# EasyEDA Pro project ProPrj_AIHi_2025-07-12.epro

# Schematic Schematic1

## Sheets
1 P1: Board Name: Board1; Create Date: 2025-07-11; Page Name: P1; Project Name: AIHi; Schematic Name: Schematic1; Update Date: 2025-07-11; Company: 嘉立创EDA; Drawed: hric; Page Size: A4; Version: V1.0
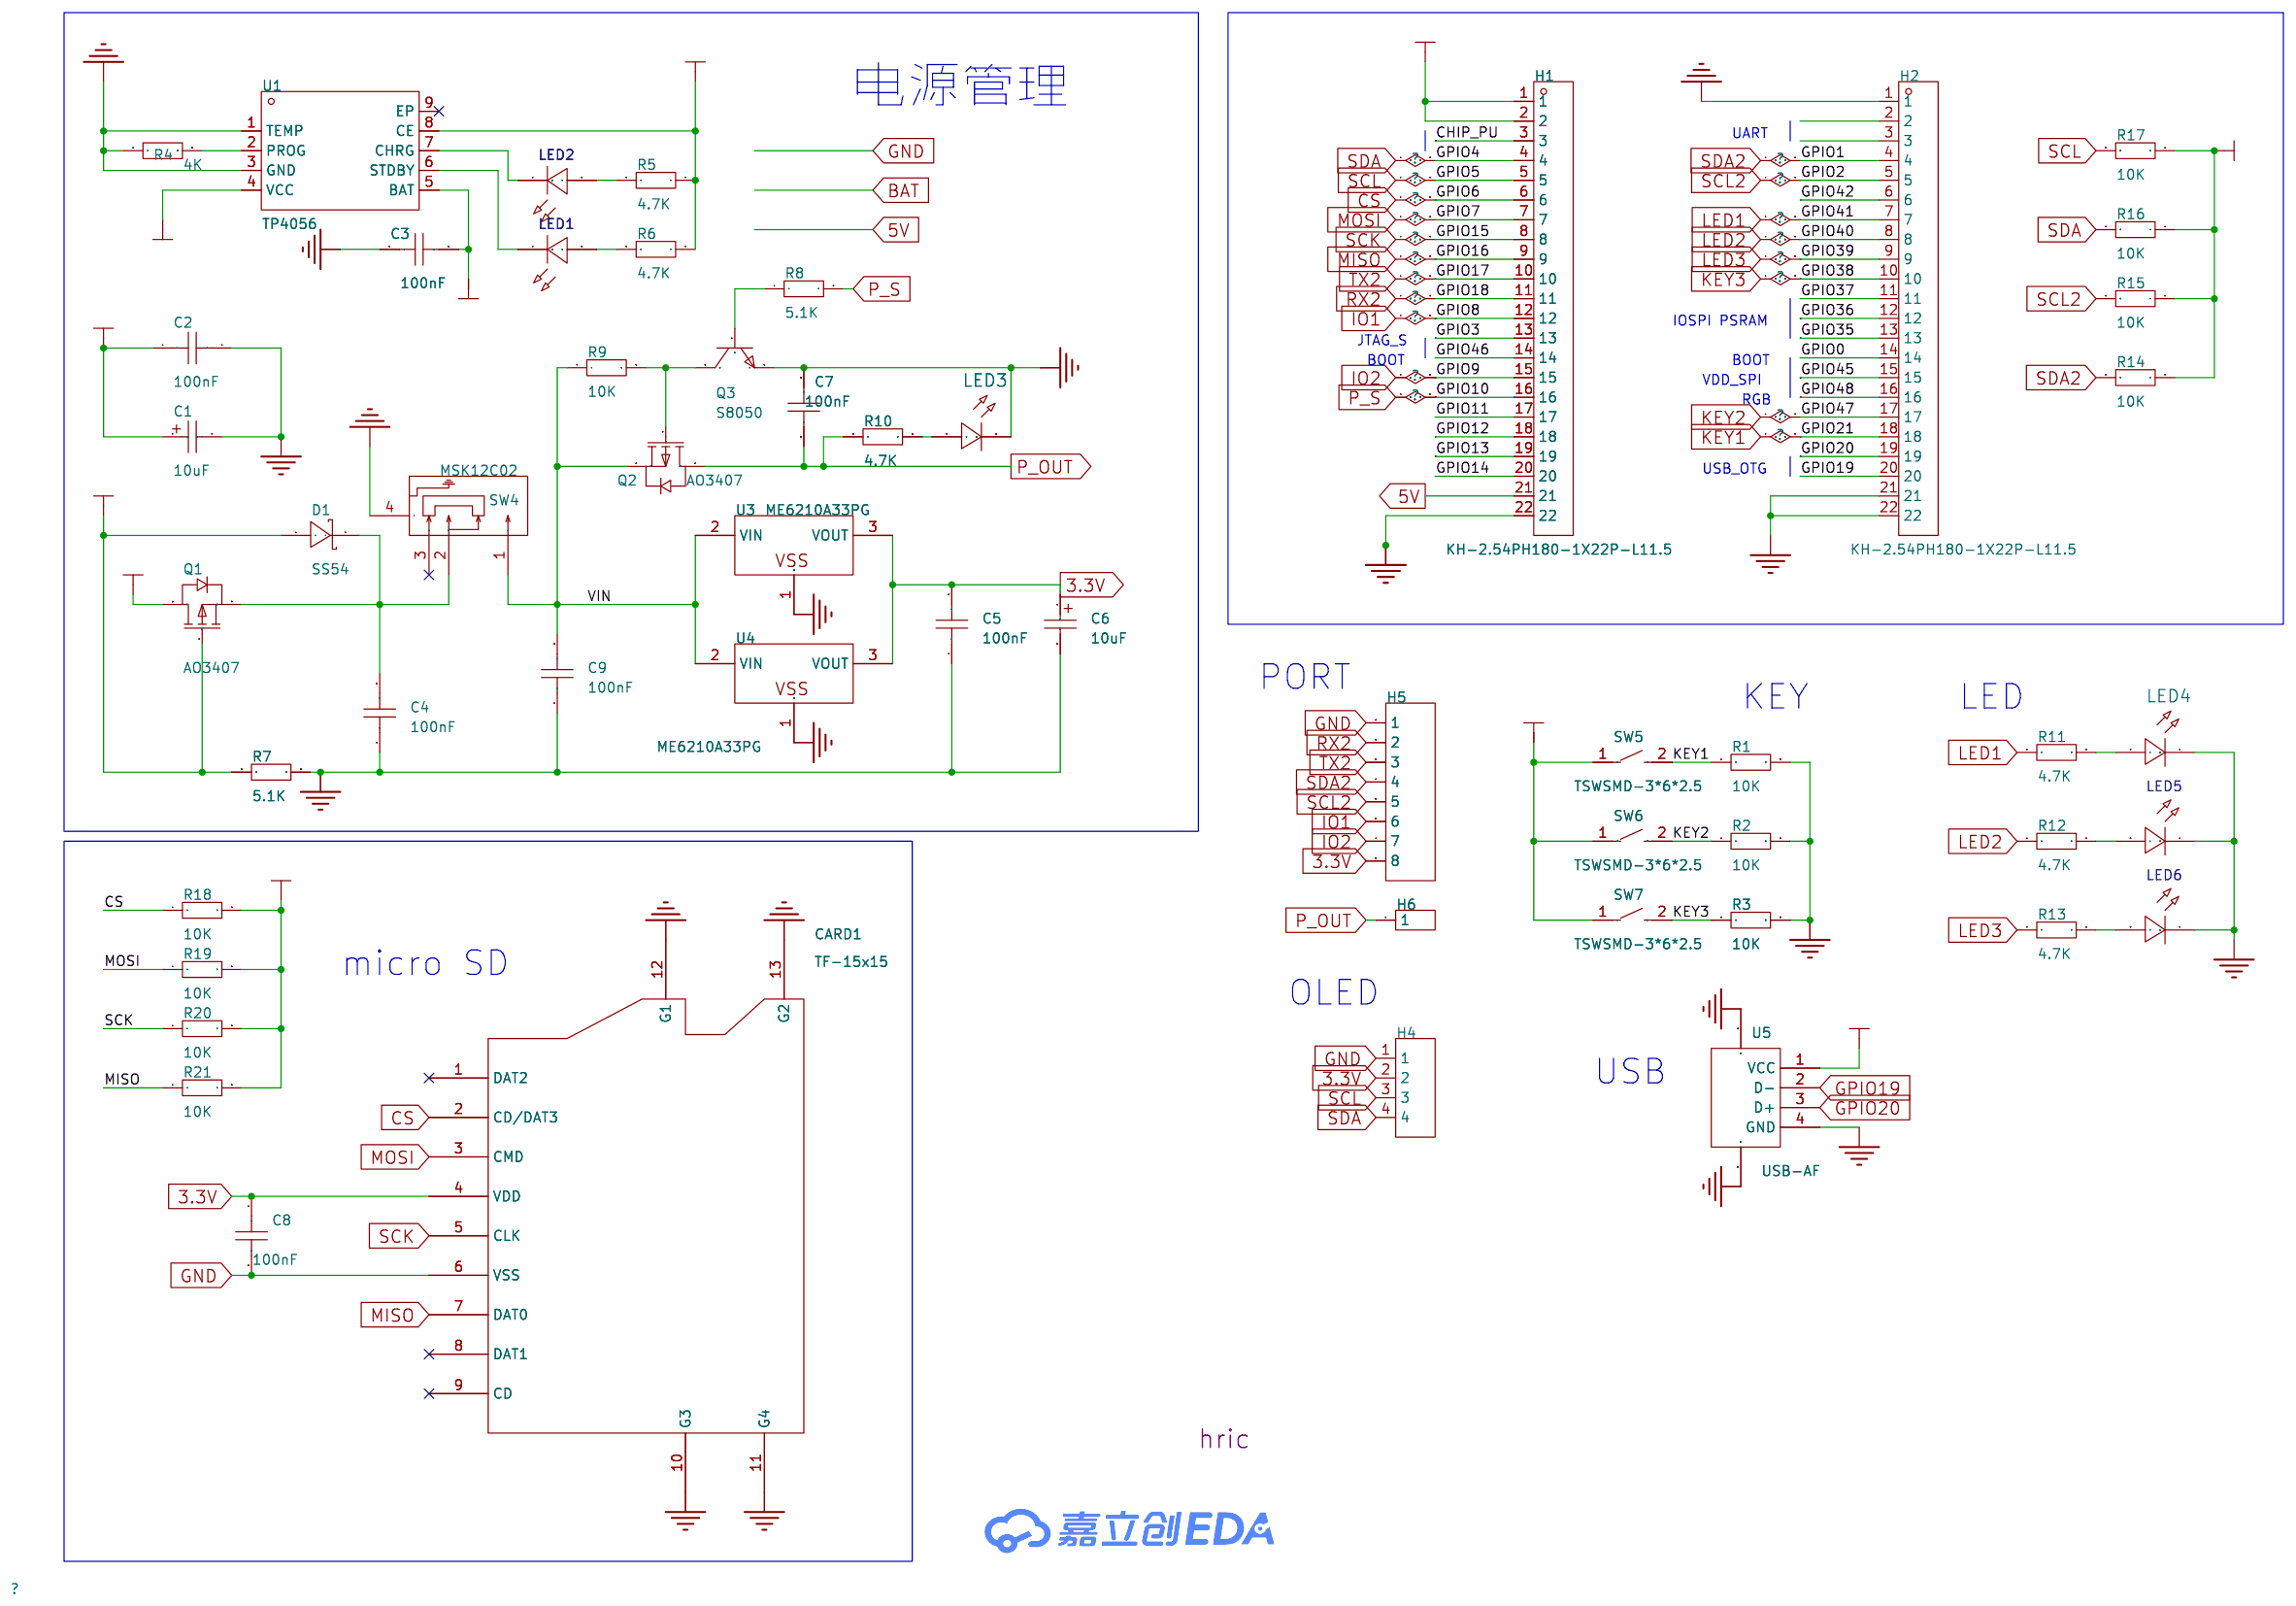
[diagram p0: P1]
2 P2
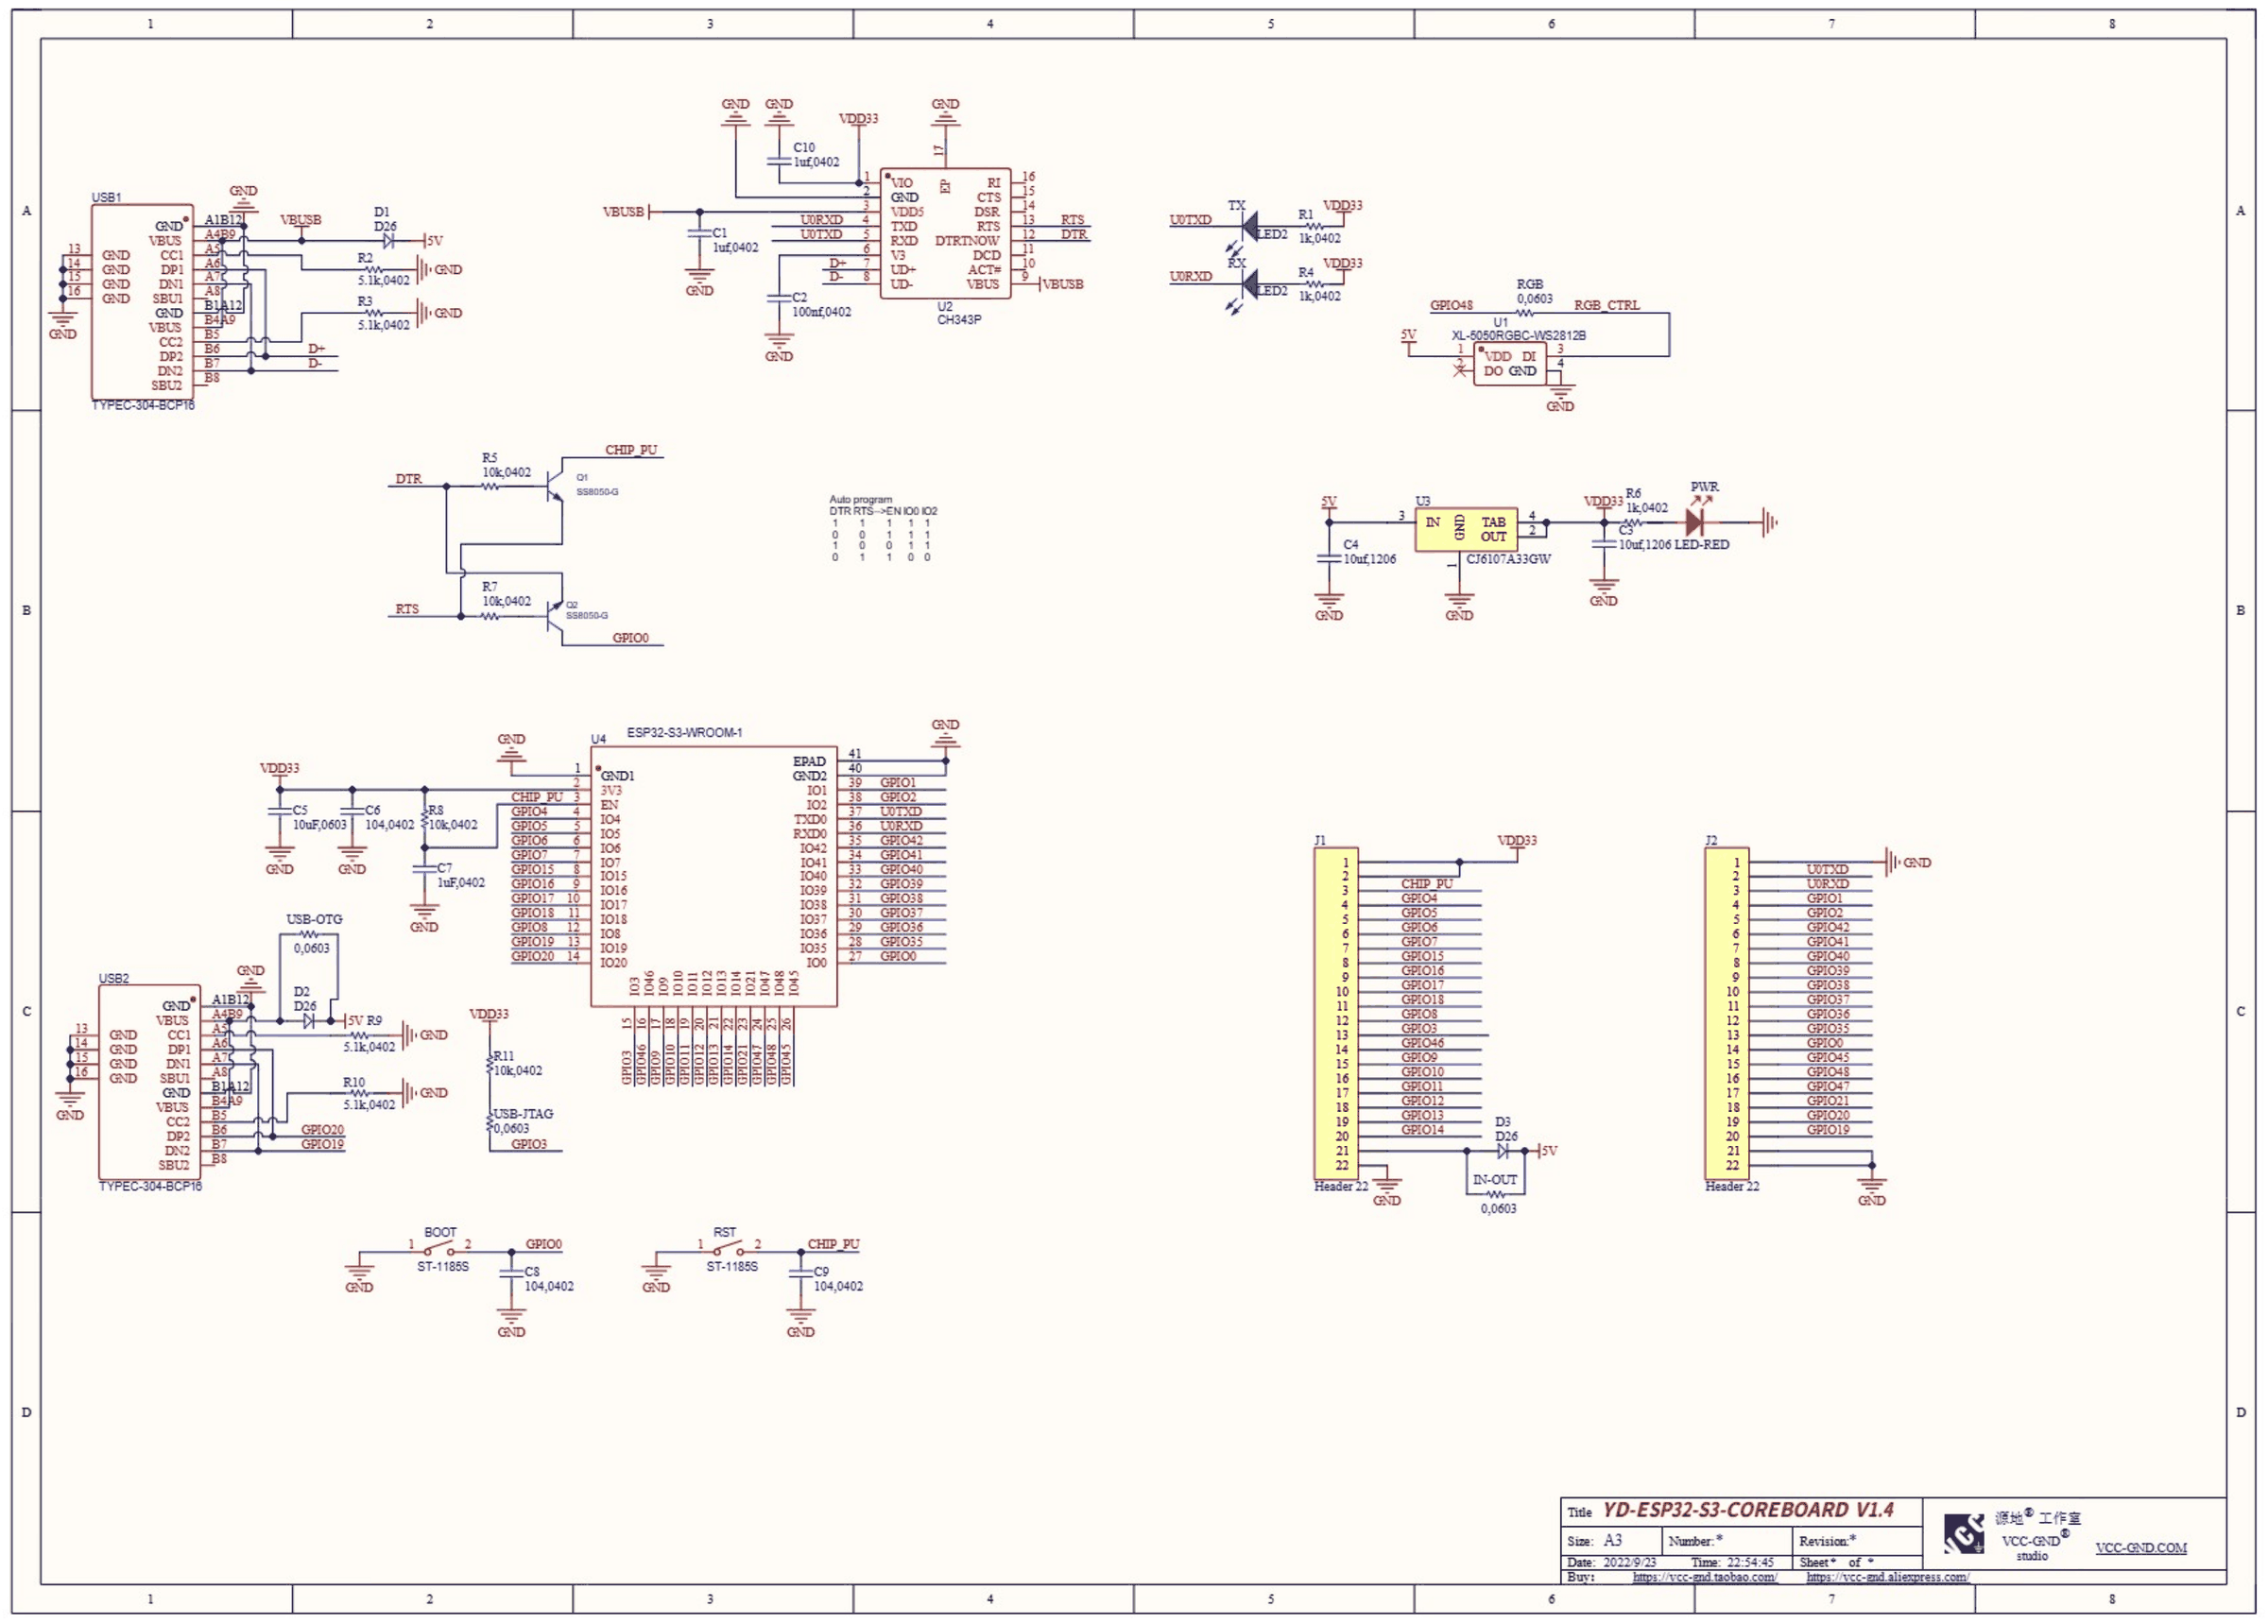
[diagram p1: P2]

## Parts
C1  10uF  [C_Ele_SMD_4x5.5mm]
C2  100nF  [C0805]
C3  100nF  [C0805]
C4  100nF  [C0805]
C5  100nF  [C0805]
C6  10uF  [C_Ele_SMD_4x5.5mm]
C7  100nF  [C0805]
C8  100nF  [C0805]
C9  100nF  [C0805]
CARD1  TF-15x15  [TF-SMD_TF-15-15]
D1  SS54  [SMA_L4.4-W2.8-LS5.4-R-RD]
H1  KH-2.54PH180-1X22P-L11.5  [HDR-TH_22P-P2.54-V-M]
H2  KH-2.54PH180-1X22P-L11.5  [HDR-TH_22P-P2.54-V-M]
H4  -  [HDR-TH_4P-P2.54-V-M]
H5  -  [HDR-TH_8P-P2.54-V-M]
H6  -  [HDR-TH_1P-V-M_XKB_X4611WV-01I-C28D40]
LED1  -  [LED_0805]
LED2  -  [LED_0805]
LED3  -  [LED_0805]
LED4  -  [LED_0805]
LED5  -  [LED_0805]
LED6  -  [LED_0805]
Q1  AO3407  [SOT-23-3_L2.9-W1.6-P1.90-LS2.8-BR]
Q2  AO3407  [SOT-23-3_L2.9-W1.6-P1.90-LS2.8-BR]
Q3  S8050  [SOT-23-3_L2.9-W1.3-P1.90-LS2.4-BR]
R1  10K  [R0805]
R2  10K  [R0805]
R3  10K  [R0805]
R4  4K  [R0805]
R5  4.7K  [R0805]
R6  4.7K  [R0805]
R7  5.1K  [R0805]
R8  5.1K  [R0805]
R9  10K  [R0805]
R10  4.7K  [R0805]
R11  4.7K  [R0805]
R12  4.7K  [R0805]
R13  4.7K  [R0805]
R14  10K  [R0805]
R15  10K  [R0805]
R16  10K  [R0805]
R17  10K  [R0805]
R18  10K  [R0805]
R19  10K  [R0805]
R20  10K  [R0805]
R21  10K  [R0805]
SW4  MSK12C02  [SW-TH_MSK12C02]
SW5  TSWSMD-3*6*2.5  [SW-SMD_L6.1-W3.6-LS8.0]
SW6  TSWSMD-3*6*2.5  [SW-SMD_L6.1-W3.6-LS8.0]
SW7  TSWSMD-3*6*2.5  [SW-SMD_L6.1-W3.6-LS8.0]
U1  TP4056  [ESOP-8_L4.9-W3.9-P1.27-LS6.0-BL-EP]
U3  ME6210A33PG  [SOT-89_L4.5-W2.5-P1.50-LS4.2-BR]
U4  ME6210A33PG  [SOT-89_L4.5-W2.5-P1.50-LS4.2-BR]
U5  USB-AF  [USB-A-TH_USB-302-T]

## Library data of the parts
C1 C6 = C_Ele_SMD_4x5.5mm: Supplier Footprint: SMD,4x5.5mm
C2-C5 C7-C9 = CAP_0805: Supplier Footprint: 0805
CARD1 = TF-15x15: 卡连接方式:自弹式;卡类型:MicroSD卡(TF卡);连接器类型:卡座;本体最大高度:2mm;工作温度:-25℃~+85℃;; LCSC Part Name: 自弹式 MicroSD卡(TF卡) 卡座; Supplier Part: C111196; Manufacturer: SOFNG(硕方); Supplier Footprint: SMD; JLCPCB Part Class: 扩展库; Datasheet: https://atta.szlcsc.com/upload/public/pdf/source/20200911/C111196_6985EA70490FD8F56A5C3F4D017F3786.pdf; Supplier: LCSC; Card Connection Mode: 自弹式; Card Type: MicroSD卡(TF卡); Connector Type: 卡座; Additional Card Detection Pins: 有; Height Above Board: 2mm; Operating Temperature: -25℃~+85℃
D1 = SS54_C22452: 二极管配置:独立式;正向压降(Vf):550mV@5A;直流反向耐压(Vr):40V;整流电流:5A;; LCSC Part Name: 电压:40V 电流:5A; Supplier Part: C22452; Manufacturer: MDD(辰达半导体); Supplier Footprint: SMA(DO-214AC); JLCPCB Part Class: 基础库; Datasheet: https://atta.szlcsc.com/upload/public/pdf/source/20240710/73DFBB65C1883B895E62D589679033DF.pdf; Supplier: LCSC; Diode Configuration: 独立式; Forward Voltage (Vf@If): 550mV@5A; Reverse Voltage (Vr): 40V; Rectified Current: 5A; Reverse Leakage Current (Ir): 1mA@40V
H1 H2 = KH-2.54PH180-1X22P-L11.5: 插针结构:1x22P;间距:2.54mm;排数:单排;; LCSC Part Name: 1x22P 间距:2.54mm; Supplier Part: C20610289; Manufacturer: kinghelm(金航标); Supplier Footprint: 插件,P=2.54mm; JLCPCB Part Class: 扩展库; Datasheet: https://atta.szlcsc.com/upload/public/pdf/source/20240117/4D3622A7E89961A992C721F36FCFC9FD.pdf; Supplier: LCSC; Pin Structure: 1x22P; Pitch: 2.54mm; Number of Rows: 单排
H4 = HDR-M_2.54_1x4P: Supplier Part: C492403; Supplier Footprint: 插件
H5 = HDR-M_2.54_1x8P: Supplier Part: C124381; Supplier Footprint: 插件
H6 = HDR-M_2.54_1x1P: Supplier Part: C81276; Supplier Footprint: 插件; JLCPCB Part Class: Extended Part
LED1 LED6 = LED_0805-B: Supplier Footprint: 0805
LED2 LED5 = LED_0805-G: Supplier Footprint: 0805
LED3 LED4 = LED_0805-R: Supplier Footprint: 0805
Q1 Q2 = AO3407: 类型:1个P沟道;漏源电压(Vdss):30V;连续漏极电流(Id):4.1A;导通电阻(RDS(on)@Vgs,Id):87mΩ@4.5V,3A;功率:350mW;阈值电压(Vgs(th)@Id):3V@250uA;; LCSC Part Name: 1个P沟道 耐压:30V 电流:4.1A; Supplier Part: C727158; Manufacturer: TWGMC(台湾迪嘉); Supplier Footprint: SOT-23; JLCPCB Part Class: 扩展库; Datasheet: https://atta.szlcsc.com/upload/public/pdf/source/20200827/C727158_282ADD6E8EE14B419EAB19F2812EAF45.pdf; Supplier: LCSC; Type: 1个P沟道; Drain Source Voltage (Vdss): 30V; Continuous Drain Current (Id): 4.1A; Drain Source On Resistance (RDS(on)@Vgs,Id): 87mΩ@4.5V,3A; Power Dissipation (Pd): 350mW; Gate Threshold Voltage (Vgs(th)@Id): 3V@250uA; Input Capacitance (Ciss@Vds): 700pF; Reverse Transfer Capacitance (Crss@Vds): 75pF; Operating Temperature: -40℃~+150℃
Q3 = S8050: NPN 25V 500mA 120-400 SOT-23; Supplier Part: C2931719; Manufacturer: Doeshare(德芯); Supplier Footprint: SOT-23; JLCPCB Part Class: 扩展库; Datasheet: https://atta.szlcsc.com/upload/public/pdf/source/20220117/E6D3315E0D6ADDB25840BFFAC039C5C0.pdf; Supplier: LCSC
R1-R21 = Res_0805: Supplier Footprint: 0805
SW4 = MSK12C02: 电路结构:单刀双掷;安装方式:卧贴;开关颜色:-;额定电流(DC):50mA;额定电压(DC):12V;额定电流(AC):-;额定电压(AC):-;机械寿命:1万次;; LCSC Part Name: 两档侧拨贴片 7脚 滑动开关; Supplier Part: C431540; Manufacturer: SHOU HAN(首韩); Supplier Footprint: SMD; JLCPCB Part Class: 扩展库; Datasheet: https://atta.szlcsc.com/upload/public/pdf/source/20190925/C431540_89155AEF0758B9AD1B2D805F83FB12E3.pdf; Supplier: LCSC; Circuit: 单刀双掷; Pin Style: SMD接片; Switch Length: 8mm; Switch Width: 2.8mm; Switch Height: 1.4mm; Mounting Style: 卧贴; Current Rating (DC): 50mA; Voltage Rating (DC): 12V; Mechanical Life: 1万次; Operating Temperature: -20℃~+70℃
SW5-SW7 = TSWSMD-3*6*2.5: Supplier Part: C9900003598; Supplier Footprint: SMD_L6.1-W3.6-LS8.0; JLCPCB Part Class: 扩展库; Supplier: LCSC
U1 = TP4056: Supplier Part: C9900002169; Supplier Footprint: ESOP-8; JLCPCB Part Class: 扩展库; Supplier: LCSC
U3 U4 = ME6210A33PG: 输出类型:固定;工作电压:18V;输出电压:3.3V;输出电流:500mA;电源纹波抑制比(PSRR):-;输出极性:正极;; LCSC Part Name: 输入18V 输出3.3V 500mA; Supplier Part: C85233; Manufacturer: MICRONE(南京微盟); Supplier Footprint: SOT-89; JLCPCB Part Class: 扩展库; Datasheet: https://atta.szlcsc.com/upload/public/pdf/source/20170316/1489630771676.pdf; Supplier: LCSC; Output Type: 固定; Voltage - Supply: 18V; Output Voltage: 3.3V; Output Current: 500mA; Voltage Dropout: 260mV@(200mA); Features: 短路保护(SCP)；低ESR; Output Configuration: 正极; Number of Outputs: 1
U5 = USB-AF: Supplier Part: C9900021158; Supplier Footprint: USB-A; JLCPCB Part Class: 扩展库; Supplier: LCSC

## Nets
3.3V: C5.2 C6.1 C8.1 CARD1.4(VDD) H1.1 H1.2 H4.2 H5.8 R14.1 R15.1 R16.1 R17.1 R18.2 R19.2 R20.2 R21.2 SW5.1 SW6.1 SW7.1 U3.3(VOUT) U4.3(VOUT)
5V: C1.1 C2.1 D1.1(A) H1.21 Q1.1(G) R5.1 R6.1 R7.1 U1.4(VCC) U1.8(CE) U5.1(VCC)
GND: C1.2 C2.2 C3.1 C4.1 C5.1 C6.2 C7.2 C8.2 C9.1 CARD1.6(VSS) CARD1.10(G3) CARD1.11(G4) CARD1.12(G1) CARD1.13(G2) H1.22 H2.1 H2.21 H2.22 H4.1 H5.1 LED3.1(C) LED4.1(C) LED5.1(C) LED6.1(C) Q3.2(E) R1.2 R2.2 R3.2 R4.1 R7.2 SW4.4 U1.1(TEMP) U1.3(GND) U3.1(VSS) U4.1(VSS) U5.4(GND) U5.5 U5.6
VIN: C9.2 Q2.2(S) R9.1 SW4.1 U3.2(VIN) U4.2(VIN)
BAT: C3.2 Q1.3(D) U1.5(BAT)
CHIP_PU: H1.3
CS: CARD1.2(CD/DAT3) H1.6 R18.1
GPIO0: H2.14
GPIO1: H2.4 H5.4 R14.2
GPIO2: H2.5 H5.5 R15.2
GPIO3: H1.13
GPIO4: H1.4 H4.4 R16.2
GPIO5: H1.5 H4.3 R17.2
GPIO7: CARD1.3(CMD) H1.7 R19.1
GPIO8: H1.12 H5.6
GPIO9: H1.15 H5.7
GPIO10: H1.16 R8.2
GPIO11: H1.17
GPIO12: H1.18
GPIO13: H1.19
GPIO14: H1.20
GPIO15: CARD1.5(CLK) H1.8 R20.1
GPIO16: CARD1.7(DAT0) H1.9 R21.1
GPIO17: H1.10 H5.3
GPIO18: H1.11 H5.2
GPIO19: H2.20 U5.2(D-)
GPIO20: H2.19 U5.3(D+)
GPIO21: H2.18 R1.1 SW5.2
GPIO35: H2.13
GPIO36: H2.12
GPIO37: H2.11
GPIO38: H2.10 R3.1 SW7.2
GPIO39: H2.9 R13.1
GPIO40: H2.8 R12.1
GPIO41: H2.7 R11.1
GPIO42: H2.6
GPIO45: H2.15
GPIO46: H1.14
GPIO47: H2.17 R2.1 SW6.2
GPIO48: H2.16
P_OUT: C7.1 H6.1 Q2.3(D) R10.1
$1N3462: R4.2 U1.2(PROG)
$1N3658: LED2.2(A) R5.2
$1N3663: LED2.1(C) U1.7(CHRG)
$1N3675: LED1.2(A) R6.2
$1N3680: LED1.1(C) U1.6(STDBY)
$1N6196: Q2.1(G) Q3.3(C) R9.2
$1N6209: Q3.1(B) R8.1
$1N6364: LED3.2(A) R10.2
$1N6397: C4.2 D1.2(K) Q1.2(S) SW4.2
$1N9881: LED4.2(A) R11.2
$1N9893: LED5.2(A) R12.2
$1N9906: LED6.2(A) R13.2

Not connected (* = marked no-connect by the designer): CARD1 1(DAT2)* 8(DAT1)* 9(CD)*; H2 2 3; SW4 3*; U1 9(EP)*

## Notes on the sheets
sheet 1
- 电源管理
- UART
- JTAG_S
- IOSPI PSRAM
- BOOT
- BOOT
- VDD_SPI
- RGB
- USB_OTG
- PORT
- KEY
- LED
- micro SD
- OLED
- USB

# Board PCB1
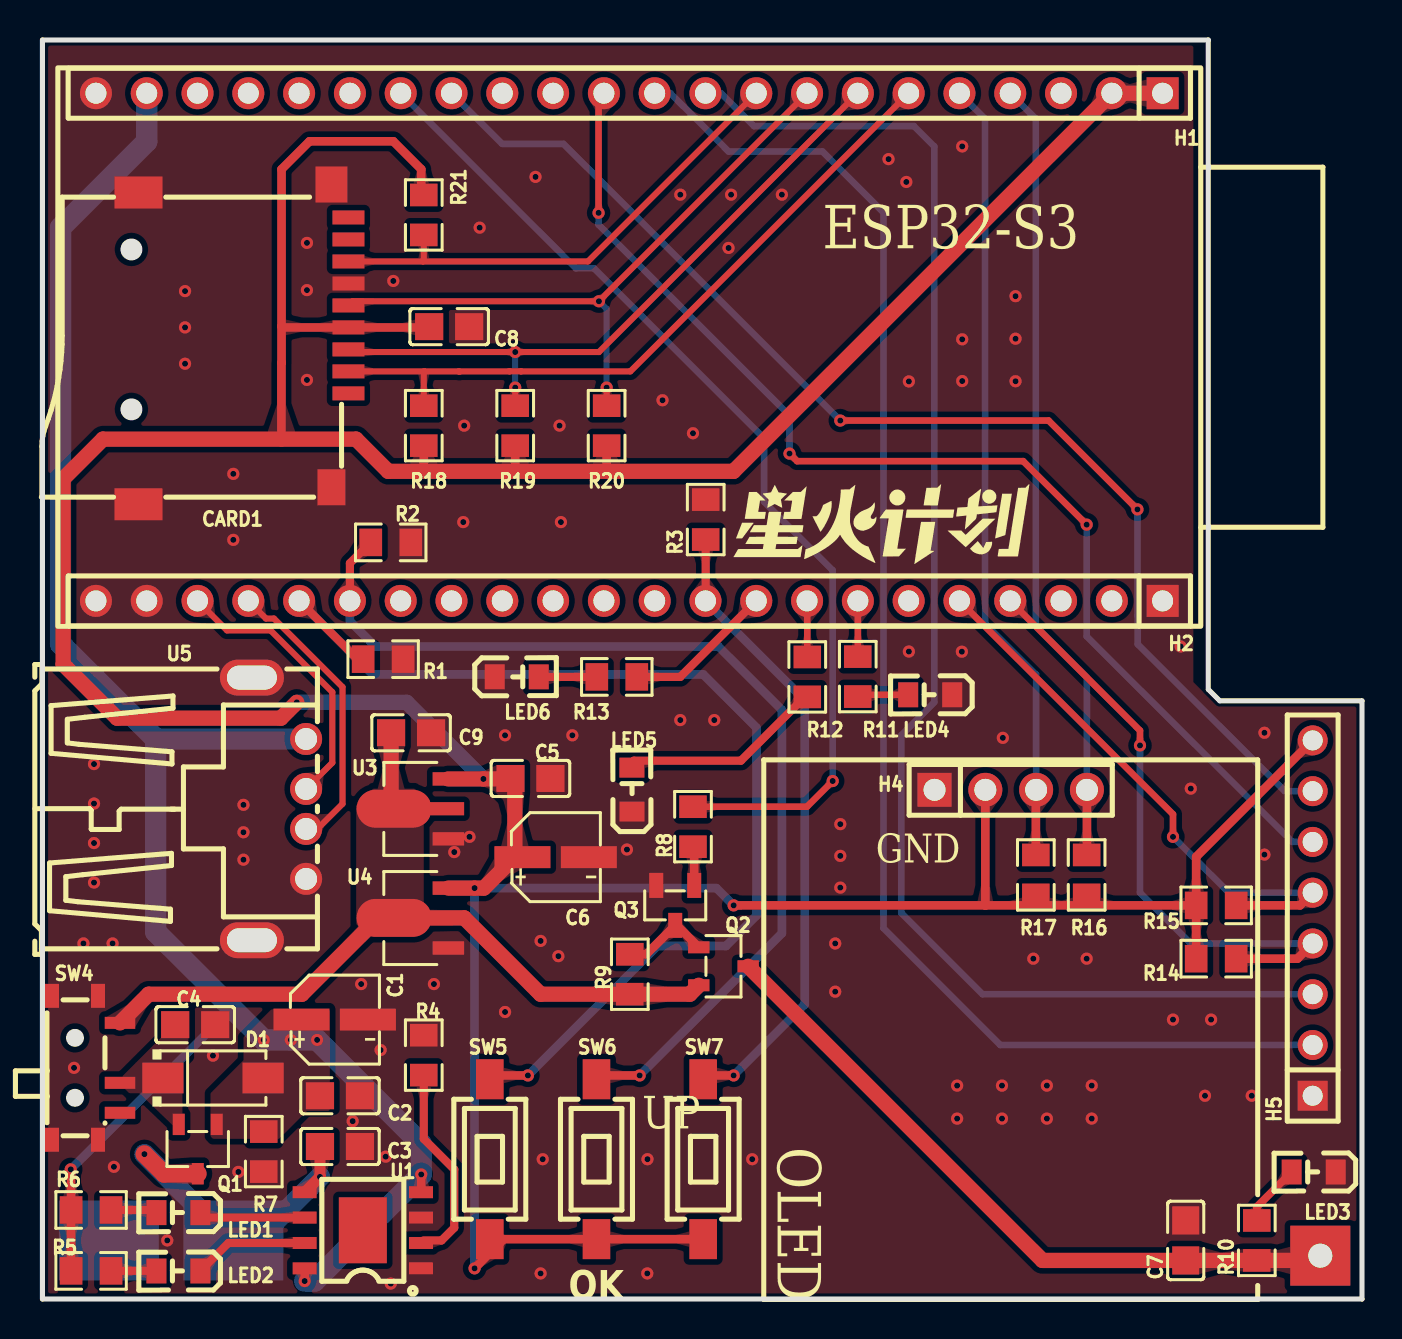
[diagram p2: board, top side]
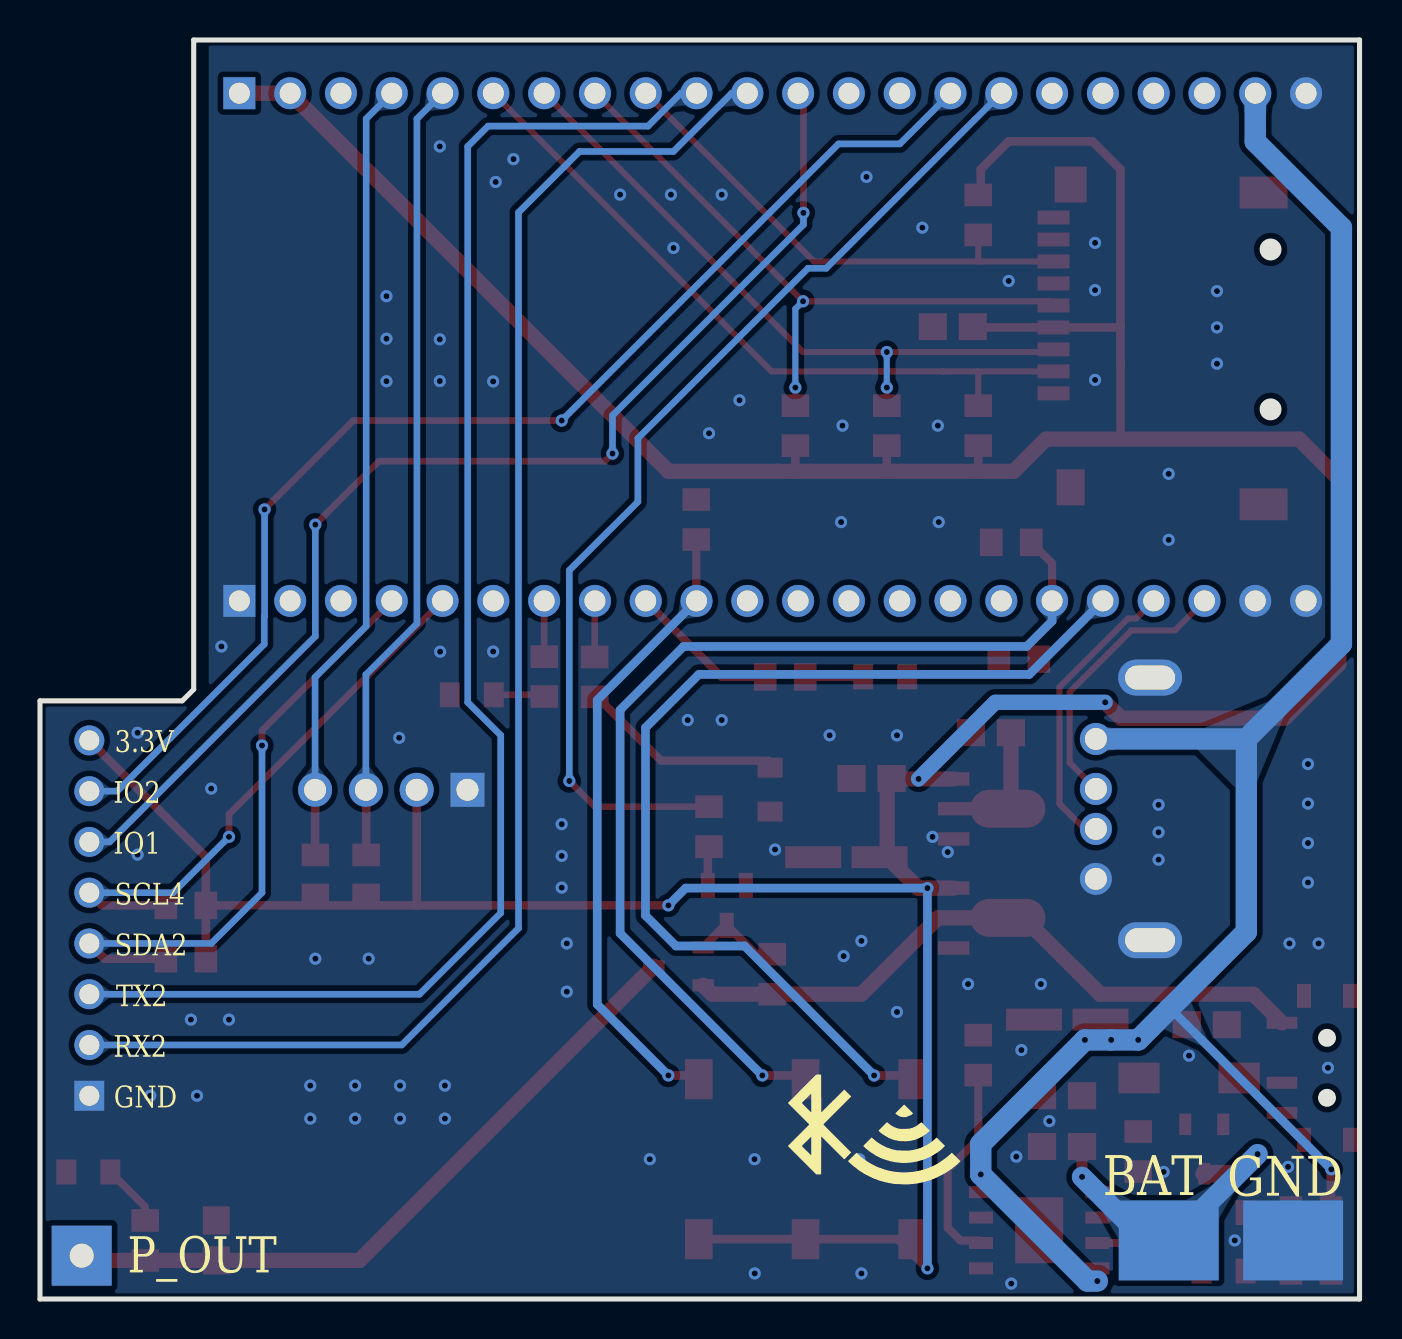
[diagram p3: board, bottom side, seen from below]

Outline 65.98 x 62.99 mm; copper layers: Top Layer, Bottom Layer. Coordinates in mm from the lower left corner of the outline.
Outline path: 0,62.99 0,0 65.98,0 65.98,29.93 58.87,29.93 58.3,30.5 58.3,62.99 0,62.99
Stack: Top Layer 0.035mm / Dielectric1 1.51mm FR4 er 4.5 / Bottom Layer 0.035mm

## Design rules (mm)
net GPIO20: DP1
net GPIO19: DP1
template: 自定义配置
spacing copperThickness1oz (default): track to track 0.102, other pairs 0.152 to 0.356
spacing copperThickness2oz: track to track 0.203, other pairs 0.152 to 0.3
track width copperThickness1oz (default): min 0.127, default 0.254, max 2.54
track width copperThickness2oz: min 0.203, default 0.254, max 2.54
differential pair differentialPair (default): width min 0.127, default 0.254, max 2.54; gap min 0.152, default 0.152
via viaSize (default): diameter min 0.5, default 0.61, max 10; hole min 0.3, default 0.305, max 6.299
net 5V uses copperRegion1
net $1N6397 uses copperRegion1
net VIN uses copperRegion1

## Placement (name value [footprint] x y rotation side)
C1  10uF  [C_Ele_SMD_4x5.5mm]  14.5 13.98 0 top
C2  100nF  [C0805]  14.88 10.17 0 top
C3  100nF  [C0805]  14.88 7.63 180 top
C4  100nF  [C0805]  7.64 13.73 180 top
C5  100nF  [C0805]  24.4 26.05 180 top
C6  10uF  [C_Ele_SMD_4x5.5mm]  25.55 22.11 0 top
C7  100nF  [C0805]  57.17 2.93 90 top
C8  100nF  [C0805]  20.34 48.65 0 top
C9  100nF  [C0805]  18.43 28.33 180 top
CARD1  TF-15x15  [TF-SMD_TF-15-15]  10.05 47.76 180 top
D1  SS54  [SMA_L4.4-W2.8-LS5.4-R-RD]  8.53 11.06 0 top
H1  KH-2.54PH180-1X22P-L11.5  [HDR-TH_22P-P2.54-V-M]  29.35 60.33 180 top
H2  KH-2.54PH180-1X22P-L11.5  [HDR-TH_22P-P2.54-V-M]  29.35 34.93 180 top
H4  -  [HDR-TH_4P-P2.54-V-M]  48.42 25.48 0 top
H5  -  [HDR-TH_8P-P2.54-V-M]  63.52 19.06 90 top
LED1  -  [LED_0805]  6.75 4.33 180 top
LED2  -  [LED_0805]  6.75 1.41 180 top
LED3  -  [LED_0805]  63.52 6.36 180 top
LED4  -  [LED_0805]  44.34 30.24 180 top
LED5  -  [LED_0805]  29.48 25.54 90 top
LED6  -  [LED_0805]  23.77 31.13 0 top
NOREF  -  [Pad_e83]  3.32 2.93 90 top
NOREF#2  -  [Pad_e90]  9.54 2.93 90 top
NOREF#3  -  [Pad_e93]  63.9 2.17 90 top
Q1  AO3407  [SOT-23-3_L2.9-W1.6-P1.90-LS2.8-BR]  7.77 7.5 90 top
Q2  AO3407  [SOT-23-3_L2.9-W1.6-P1.90-LS2.8-BR]  34.05 16.65 180 top
Q3  S8050  [SOT-23-3_L2.9-W1.3-P1.90-LS2.4-BR]  31.64 19.7 90 top
R1  10K  [R0805]  17.04 32.01 0 top
R2  10K  [R0805]  17.42 37.86 0 top
R3  10K  [R0805]  33.17 39 90 top
R4  4K  [R0805]  19.07 12.2 270 top
R5  4.7K  [R0805]  2.43 1.41 0 top
R6  4.7K  [R0805]  2.43 4.46 0 top
R7  5.1K  [R0805]  11.07 7.38 270 top
R8  5.1K  [R0805]  32.53 23.63 90 top
R9  10K  [R0805]  29.37 16.25 90 top
R10  4.7K  [R0805]  60.73 2.93 90 top
R11  4.7K  [R0805]  40.77 31.14 270 top
R12  4.7K  [R0805]  38.25 31.13 270 top
R13  4.7K  [R0805]  28.72 31.13 180 top
R14  10K  [R0805]  58.69 17.03 0 top
R15  10K  [R0805]  58.69 19.7 0 top
R16  10K  [R0805]  52.22 21.22 90 top
R17  10K  [R0805]  49.68 21.22 90 top
R18  10K  [R0805]  19.07 43.7 270 top
R19  10K  [R0805]  23.64 43.7 270 top
R20  10K  [R0805]  28.21 43.7 270 top
R21  10K  [R0805]  19.07 54.24 90 top
SW4  MSK12C02  [SW-TH_MSK12C02]  2.18 11.57 270 top
SW5  TSWSMD-3*6*2.5  [SW-SMD_L6.1-W3.6-LS8.0]  22.37 7 90 top
SW6  TSWSMD-3*6*2.5  [SW-SMD_L6.1-W3.6-LS8.0]  27.7 7 90 top
SW7  TSWSMD-3*6*2.5  [SW-SMD_L6.1-W3.6-LS8.0]  33.04 7 90 top
U1  TP4056  [ESOP-8_L4.9-W3.9-P1.27-LS6.0-BL-EP]  16.02 3.44 90 top
U3  ME6210A33PG  [SOT-89_L4.5-W2.5-P1.50-LS4.2-BR]  18.94 24.52 0 top
U4  ME6210A33PG  [SOT-89_L4.5-W2.5-P1.50-LS4.2-BR]  18.94 19.06 0 top
U5  USB-AF  [USB-A-TH_USB-302-T]  11.83 24.52 270 top

## Footprints (pads in the part's own frame, mm; a bottom-side part is the same pattern mirrored in y, then rotated)
C0805
  rect 1.41x1.35 smd: 1(-1,0) 2(1,0)
C_Ele_SMD_4x5.5mm
  rect 2.8x1.1 smd: 1(-1.543,0) 2(1.778,0)
ESOP-8_L4.9-W3.9-P1.27-LS6.0-BL-EP
  rect 0.6x1.2 smd: 1(-1.905,-2.909) 2(-0.635,-2.909) 3(0.635,-2.909) 4(1.905,-2.909) 5(1.905,2.909) 6(0.635,2.909) 7(-0.635,2.909) 8(-1.905,2.909)
  rect 3.3x2.4 smd: 9(0,0)
HDR-TH_4P-P2.54-V-M
  rect 1.7x1.7 hole 1.1: 1(-3.81,0)
  round 1.7 hole 1.1: 2(-1.27,0) 3(1.27,0) 4(3.81,0)
HDR-TH_8P-P2.54-V-M
  rect 1.5x1.5 hole 1: 1(-8.89,0)
  round 1.5 hole 1: 2(-6.35,0) 3(-3.81,0) 4(-1.27,0) 5(1.27,0) 6(3.81,0) 7(6.35,0) 8(8.89,0)
HDR-TH_22P-P2.54-V-M
  rect 1.6x1.6 hole 1.05: 1(-26.67,0)
  round 1.6 hole 1.05: 2(-24.13,0) 3(-21.59,0) 4(-19.05,0) 5(-16.51,0) 6(-13.97,0) 7(-11.43,0) 8(-8.89,0) 9(-6.35,0) 10(-3.81,0) 11(-1.27,0) 12(1.27,0) 13(3.81,0) 14(6.35,0) 15(8.89,0) 16(11.43,0) 17(13.97,0) 18(16.51,0) 19(19.05,0) 20(21.59,0) 21(24.13,0) 22(26.67,0)
LED_0805
  rect 1x1.25 smd: 1(-1.15,0.005) 2(1.05,0.005)
Pad_e83
  rect 4x5 smd far side: 1(0,0)
Pad_e90
  rect 4x5 smd far side: 2(0,0)
Pad_e93
  rect 3x3 hole 1.2: 6(0,0)
R0805
  rect 1.133x1.377 smd: 1(-1,0) 2(1,0)
SMA_L4.4-W2.8-LS5.4-R-RD
  rect 2.062x1.539 smd: 1(2.503,0) 2(-2.503,0)
SOT-23-3_L2.9-W1.3-P1.90-LS2.4-BR
  rect 1.25x0.7 smd: 1(1,-0.95) 2(1,0.95) 3(-1,0)
SOT-23-3_L2.9-W1.6-P1.90-LS2.8-BR
  rect 1.07x0.6 smd: 1(1.235,-0.95) 2(1.235,0.95) 3(-1.235,0)
SOT-89_L4.5-W2.5-P1.50-LS4.2-BR
  rect 1.575x0.672 smd: 1(1.356,-1.5) 3(1.356,1.5)
  custom 5.377x1.9 smd: 2(-1.356,0.009)
SW-SMD_L6.1-W3.6-LS8.0
  rect 2x1.38 smd: 1(-4,0) 2(4,0)
SW-TH_MSK12C02
  rect 0.6x1.524 smd: 1(-2.25,1.7) 2(0.75,1.7) 3(2.25,1.7)
  rect 1.2x0.7 smd: 4(-3.6,0.6) 4(-3.6,-1.7) 4(3.6,0.6) 4(3.6,-1.7)
TF-SMD_TF-15-15
  rect 1.6x0.701 smd: 1(-5.252,2.45) 2(-5.252,1.35) 3(-5.252,0.25) 4(-5.252,-0.85) 5(-5.252,-1.95) 6(-5.252,-3.05) 7(-5.252,-4.15) 8(-5.252,-5.25) 9(-5.252,-6.35)
  rect 1.6x1.8 smd: 10(-4.399,-8)
  rect 2.4x1.6 smd: 11(5.252,-7.6) 12(5.252,8)
  rect 1.399x1.801 smd: 13(-4.398,7.151)
USB-A-TH_USB-302-T
  round 1.6 hole 1.1: 1(-3.5,1.355) 2(-1,1.355) 3(1,1.355) 4(3.5,1.355)
  oval 1.8x3.2 hole 1.2x2.5: 5(-6.57,-1.355) 6(6.57,-1.355)

## Nets
As in the schematic, except:
GND: C1.2 C2.2 C3.1 C4.1 C5.1 C6.2 C7.2 C8.2 C9.1 CARD1.6 CARD1.10 CARD1.11 CARD1.12 CARD1.13 H1.22 H2.1 H2.21 H2.22 H4.1 H5.1 LED3.1 LED4.1 LED5.1 LED6.1 NOREF.1 Q3.2 R1.2 R2.2 R3.2 R4.1 R7.2 SW4.4 U1.1 U1.3 U3.1 U4.1 U5.4 U5.5 U5.6
BAT: C3.2 NOREF#2.2 Q1.3 U1.5
P_OUT: C7.1 NOREF#3.6 Q2.3 R10.1

Pads without a net: CARD1 1 8 9; SW4 3; U1 9

## Via types
v1: diameter 0.61, hole 0.305, Top Layer to Bottom Layer, 119 vias

## Routing (per net, layer and track width the routed paths; a pad name or vN(x,y) marks a point on that pad's centre or on a via; arc(x,y) is an arc through that point)
3.3V: length 229.7
  Top Layer w0.432: 11.95,43.02 11.95,46.83 11.96,46.83 11.96,48.67 ; H4.2 47.15,19.7 47.15,19.7 ; R21.2 18.94,55.37 18.94,56.53 17.55,57.92 13.35,57.92 11.96,56.53 11.96,48.67 ; R15.1 47.15,19.7 ; R15.1 57.69,22.12 H5.8 ; R15.1 R14.1 ; 47.15,19.7 v1(34.56,19.7) ; 11.96,48.67 12.02,48.61 19.3,48.61 C8.1 ; R19.2 23.64,41.46 23.59,41.41 ; v1(21.61,1.53) 23.07,3 SW6.1 SW7.1 ; 28.26,41.41 28.21,41.46 R20.2 ; 19.1,41.41 19.07,41.44 R18.2
  Top Layer w0.762: U3.3 v1(22.05,26.02) 23.38,26.02 C5.2 23.62,25.83 23.62,22.11 22.07,20.56 v1(21.61,20.56) U4.3 ; v1(12.72,29.86) 11.93,29.06 3.73,29.06 1.03,31.76 1.03,41.03 3.03,43.02 15.68,43.02 17.29,41.41 34.56,41.41 H1.2 H1.1
  Bottom Layer w0.432: v1(34.56,19.7) 33.7,20.56 v1(21.61,20.56) v1(21.61,1.53)
  Bottom Layer w0.762: v1(12.72,29.86) 18.22,29.86 v1(22.05,26.02)
5V: length 98.5
  Top Layer w0.432: v1(1.42,6.49) 1.43,6.47 R6.1 R5.1 ; U1.8 v1(13.11,0.9) ; U1.4 18.94,5.36 v1(18.94,6.23)
  Bottom Layer w0.432: 9.5,14.54 9.46,14.54 v1(1.42,6.49)
  Bottom Layer w1.067: H1.21 5.22,57.91 0.91,53.6 0.91,32.78 5.66,28.02 ; 5.66,28.02 U5.1 ; 5.66,28.02 5.66,18.37 v1(11.07,12.96) v1(12.42,12.96) v1(13.73,12.96) 18.94,7.76 v1(18.94,6.23) 13.61,0.9 v1(13.11,0.9)
GND:
  vias: v1(1.58,11.57) v1(2.05,17.79) v1(2.58,26.77) v1(2.58,24.79) v1(2.58,22.81) v1(2.58,20.84) v1(3.51,17.79) v1(3.57,6.61) v1(6.24,2.93) v1(7.13,50.43) v1(7.13,48.61) v1(7.13,46.8) v1(8.53,12.18) v1(9.54,41.29) v1(9.54,37.98) v1(9.8,6.36) v1(10.05,24.73) v1(10.05,23.35) v1(10.05,21.98) v1(13.23,52.84) v1(13.23,50.48) v1(13.23,45.98) v1(15.51,8.9) v1(15.94,15.76) v1(16.91,12.46) v1(17.16,7.12) v1(17.42,0.77) v1(17.55,50.94) v1(19.58,15.76) v1(20.59,22.36) v1(21.09,43.7) v1(21.04,38.87) v1(21.36,23.12) v1(21.86,53.6) v1(23.13,28.2) v1(23.13,14.36) v1(24.66,56.14) v1(24.91,17.92) v1(24.91,1.28) v1(25.02,7) v1(25.86,43.7) v1(25.8,17.16) v1(25.93,38.87) v1(26.5,28.2) v1(29.23,22.49) v1(30.25,7) v1(30.24,1.28) v1(31.01,44.97) v1(31.9,55.26) v1(31.9,28.97) v1(32.53,43.32) v1(33.59,28.97) v1(34.31,52.59) v1(34.44,55.26) v1(35.49,7) v1(36.98,55.26) v1(39.64,17.79) v1(39.64,15.38) v1(39.9,23.76) v1(39.9,22.17) v1(39.9,20.58) v1(42.31,57.03) v1(43.2,55.89) v1(43.33,45.91) v1(43.33,32.4) v1(45.74,10.68) v1(45.74,9.03) v1(45.98,32.39) v1(45.99,57.67) v1(45.99,48.02) v1(45.99,45.93) v1(47.98,10.68) v1(47.98,9.03) v1(48.02,28.08) v1(48.66,50.18) v1(48.66,48.05) v1(48.66,45.92) v1(49.55,17.03) v1(50.23,10.68) v1(50.23,9.03) v1(52.22,17.03) v1(52.47,10.68) v1(52.47,9.03) v1(56.53,13.98) v1(56.92,32.65) v1(57.42,25.54) v1(58.13,10.17) v1(58.44,13.98) v1(60.47,10.17) v1(61.11,28.33) v1(61.11,22.24)
VIN: length 36.7
  Top Layer w0.762: U3.2 17.43,24.68 C9.2 ; Q2.2 32.37,15.25 R9.1 24.91,15.25 21.09,19.07 U4.2 16.79,19.07 12.97,15.25 5.31,15.25 SW4.1
BAT: length 17.4
  Top Layer w0.559: C3.2 v1(13.88,6.11) U1.5
  Top Layer w0.889: Q1.3 6.08,6.27 v1(5.1,7.25)
  Bottom Layer w1.016: NOREF#2.2 10.7,2.93 v1(13.88,6.11) ; v1(5.1,7.25) 9.42,2.93
CS: length 35.5
  Top Layer w0.305: CARD1.2 19.1,46.41 ; 19.1,46.41 19.07,46.38 R18.1 ; 19.1,46.41 20.83,46.41 ; 20.83,46.41 20.85,46.39 ; 20.83,46.41 23.35,46.41 23.36,46.42 23.92,46.42 23.93,46.41 29.4,46.41 H1.6
GPIO1: length 31.1
  Top Layer w0.33: v1(54.88,27.7) 54.88,28.44 H2.4
  Top Layer w0.432: R14.2 62.76,17.03 H5.4
  Bottom Layer w0.33: H5.4 57.42,17.79 54.88,20.33 v1(54.88,27.7)
GPIO2: length 28.5
  Top Layer w0.33: H2.5 56.53,24.25 v1(56.53,23.12)
  Top Layer w0.432: H5.5 62.88,19.7 R15.2
  Bottom Layer w0.33: v1(56.53,23.12) 59.33,20.33 H5.5
GPIO4: length 39.7
  Top Layer w0.432: R16.2 52.23,22.23 H4.4
  Bottom Layer w0.33: H4.4 52.23,31.11 49.68,33.67 49.68,59.05 H1.4
GPIO5: length 39.7
  Top Layer w0.432: H4.3 49.68,25.46 R17.2
  Bottom Layer w0.33: H1.5 47.14,59.05 47.14,33.79 49.69,31.24 H4.3
GPIO7: length 33.6
  Top Layer w0.305: CARD1.3 15.43,47.38 v1(23.64,47.38) 27.83,47.38 H1.7 ; R19.1 v1(23.64,45.6)
  Bottom Layer w0.305: v1(23.64,45.6) v1(23.64,47.38)
GPIO8: length 59.6
  Top Layer w0.33: v1(52.22,38.75) 49.04,41.92 37.74,41.92 v1(37.36,42.3) ; H1.12 27.81,60.06 v1(27.81,54.34)
  Bottom Layer w0.33: v1(27.81,54.34) 27.81,53.75 37.36,44.21 v1(37.36,42.3) ; v1(52.22,38.75) 52.22,33.16 62.5,22.87 H5.6
GPIO9: length 61.5
  Top Layer w0.33: v1(54.76,39.51) 50.31,43.95 v1(39.9,43.95)
  Bottom Layer w0.33: H1.15 22.99,57.8 26.05,57.8 v1(39.9,43.95) ; v1(54.76,39.51) 54.76,34.17 54.77,34.16 54.77,32.76 62.12,25.41 H5.7
GPIO10: length 51.4
  Top Layer w0.33: v1(39.52,25.92) 38.23,24.63 R8.2
  Bottom Layer w0.33: v1(39.52,25.92) 39.52,36.46 36.09,39.89 36.09,43.06 27.58,51.57 26.67,51.57 H1.16
GPIO15: length 32.7
  Top Layer w0.305: CARD1.5 15.51,49.92 v1(27.83,49.92) H1.8 ; R20.1 v1(28.21,45.6)
  Bottom Layer w0.305: v1(28.21,45.6) 28.21,49.54 27.83,49.92
GPIO16: length 25.2
  Top Layer w0.305: H1.9 27.28,51.91 19.03,51.91 ; 19.03,51.91 19.07,51.95 R21.1 ; 19.03,51.91 CARD1.7
GPIO17: length 73.8
  Bottom Layer w0.33: H1.10 33.94,60.33 35.58,58.68 43.58,58.68 44.6,57.67 44.6,29.86 42.95,28.2 42.95,19.31 47.01,15.25 H5.3
GPIO18: length 73.6
  Bottom Layer w0.33: H5.2 47.9,12.71 42.06,18.55 42.06,54.37 39.01,57.41 34.31,57.41 31.4,60.33 H1.11
GPIO19: length 14
  Top Layer w0.305: U5.2 14.5,26.83 14.5,30.36 11.41,33.45 9.23,33.45 H2.20
GPIO20: length 14.7
  Top Layer w0.305: U5.3 13.75,23.52 15,24.78 15,30.62 11.58,34.05 11.18,34.05 H2.19
GPIO21: length 56
  Top Layer w0.406: R1.1 15.75,32.01 H2.18
  Top Layer w0.432: SW5.2 22.56,11.19 v1(24.28,11.19)
  Bottom Layer w0.432: H2.18 16.51,31.25 33.04,31.25 35.71,28.59 35.71,19.19 34.18,17.66 30.75,17.66 v1(24.28,11.19)
GPIO38: length 32.2
  Top Layer w0.406: 33.17,38.25 33.17,34.94 H2.10
  Top Layer w0.432: SW7.2 33.23,11.19 v1(34.56,11.19)
  Bottom Layer w0.432: v1(34.56,11.19) 38.12,14.74 38.12,29.97 H2.10
GPIO39: length 7.6
  Top Layer w0.406: H2.9 31.89,31.13 R13.1
GPIO40: length 2.8
  Top Layer w0.33: R12.1 38.25,34.92 H2.8
GPIO41: length 2.8
  Top Layer w0.33: H2.7 40.78,32.15 R11.1
GPIO47: length 51.3
  Top Layer w0.406: R2.1 15.38,36.81 H2.17
  Top Layer w0.432: v1(29.86,11.19) 27.9,11.19 SW6.2
  Bottom Layer w0.432: H2.17 15.38,33.92 16.65,32.65 33.8,32.65 36.98,29.47 36.98,18.3 v1(29.86,11.19)
P_OUT: length 34.8
  Top Layer w0.762: Q2.3 50.01,1.93 C7.1 R10.1 63.66,1.93 NOREF#3.6
$1N3462: length 10.1
  Top Layer w0.406: 19.06,2.93 19.96,2.93 20.59,3.57 20.59,6.49 19.07,8.01 R4.2
$1N3658: length 2.3
  Top Layer w0.406: LED2.2 5.69,1.41 R5.2
$1N3663: length 5.8
  Top Layer w0.406: U1.7 9.3,2.8 LED2.1
$1N3675: length 2.3
  Top Layer w0.406: LED1.2 5.57,4.46 R6.2
$1N3680: length 5.3
  Top Layer w0.406: U1.6 8.15,4.07 LED1.1
$1N6196: length 4.5
  Top Layer w0.432: R9.2 30.2,17.25 Q3.3 31.72,18.7 Q2.1
$1N6209: length 2
  Top Layer w0.432: Q3.1 32.59,22.57 R8.1
$1N6364: length 3.1
  Top Layer w0.381: LED3.2 60.73,4.61 R10.2
$1N9881: length 2.6
  Top Layer w0.33: R11.2 40.77,30.23 LED4.2
$1N9893: length 10.5
  Top Layer w0.406: 29.22,26.59 29.57,26.93 34.93,26.93 38.12,30.13 R12.2
$1N9906: length 2.9
  Top Layer w0.406: LED6.2 24.82,31.13 R13.2

## Copper pours and planes (outline as drawn; the poured copper is in the pictures)
3.3V on Top Layer: 21.85,26.15 23.62,26.15 23.62,24.66 21.85,24.66
5V on Top Layer: 14.37,14.49 14.37,9.41 13.23,9.41 11.83,8.01 8.53,8.01 8.4,8.14 8.4,10.3 10.05,11.95 10.05,13.1 11.44,14.49
GND on Top Layer: 57.3,63.64 57.55,63.38 57.55,30.87 58.3,30.12 67.7,30.12 68.09,29.73 68.09,-1.51 -1.76,-1.51 -2.01,-1.26 -2.01,62.88 -2.14,63 -1.51,63.64
GND on Bottom Layer: -1.89,64.15 56.92,64.15 57.55,63.51 57.55,30.87 58.18,30.24 66.31,30.24 66.82,29.73 66.82,-0.62 66.31,-1.13 -0.87,-1.13 -1.89,-0.12
VIN on Top Layer: 16.53,25.54 15.69,24.7 15.69,18.76 16.27,18.17 18.69,18.17 19.32,18.81 19.32,19.57 19.07,19.82 19.07,25.09 18.62,25.54
$1N6397 on Top Layer: 4,11.16 5.93,13.09 5.93,14.34 7.3,14.34 7.3,12.12 7,11.82 7,8.23 4.84,10.3 4.34,10.3 4,10.63

Small or netless copper shapes (teardrops, artwork), in the pictures only: 147 on Top Layer, 43 on Bottom Layer

## Text on the board
Bottom Silkscreen Layer: P_OUT | GND | BAT | TX2 | 3.3V | SCL4 | SDA2 | IO2 | IO1 | RX2
Top Silkscreen Layer: OLED | ESP32-S3 | GND | UP | OK
